# EAGLE schematic serra1 (EAGLE 7.5.0)
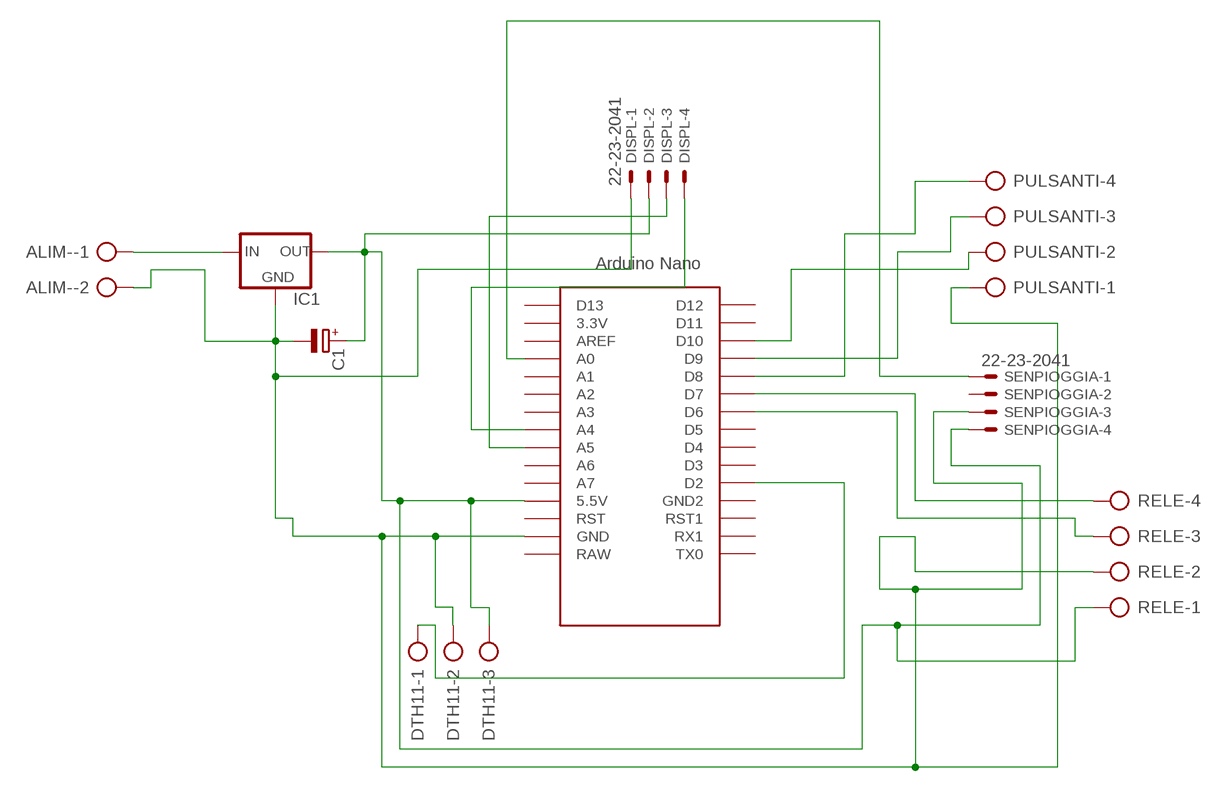
[diagram p0: schematic, sheet 1]

## Parts
ALIM-  AK500/2  [AK500/2]
C1  CPOL-EUE5-13  [E5-13]
DISPL  22-23-2041  [22-23-2041]
DTH11  AK500/3  [AK500/3]
IC1  78XXS  [78XXS]
PULSANTI  AK500/4  [AK500/4]
RELE  AK500/4  [AK500/4]
SENPIOGGIA  22-23-2041  [22-23-2041]
U$1  NANO  [NANO]

## Nets
DTH11: C1.+ DISPL.2 DTH11.3 IC1.OUT RELE.1 SENPIOGGIA.4 U$1.5V(5.5V)
N$1: ALIM-.1 IC1.IN
N$2: SENPIOGGIA.1 U$1.A0
N$3: RELE.4 U$1.D7
N$4: DISPL.3 U$1.A5
N$5: PULSANTI.2 U$1.D10
N$6: RELE.3 U$1.D6
N$7: DISPL.4 U$1.A4
N$8: DTH11.1 U$1.D2
N$9: ALIM-.2 C1.- DISPL.1 DTH11.2 IC1.GND PULSANTI.1 RELE.2 SENPIOGGIA.3 U$1.GND
N$10: PULSANTI.4 U$1.D8
N$12: PULSANTI.3 U$1.D9
Unconnected: SENPIOGGIA.2 U$1.3.3V U$1.A1 U$1.A2 U$1.A3 U$1.A6 U$1.A7 U$1.AREF U$1.D3 U$1.D4 U$1.D5 U$1.D11 U$1.D12 U$1.D13 U$1.GND1(GND2) U$1.ICSP1 U$1.ICSP2 U$1.ICSP3 U$1.ICSP4 U$1.ICSP5 U$1.ICSP6 U$1.RAW U$1.RST U$1.RST1 U$1.RX1 U$1.TX0

## Library data of the parts
ALIM- = con-pcb5mm:AK500/2: CONNECTOR; OC_FARNELL: unknown; OC_NEWARK: unknown
C1 = rcl:CPOL-EU: POLARIZED CAPACITOR, European symbol
DISPL SENPIOGGIA = con-molex:22-23-2041: .100" (2.54mm) Center Header - 4 Pin; MF: MOLEX; MPN: 22-23-2041; OC_FARNELL: 1462920; OC_NEWARK: 38C0355
DTH11 = con-pcb5mm:AK500/3: CONNECTOR; OC_FARNELL: unknown; OC_NEWARK: unknown
IC1 = v-reg:78XXS: VOLTAGE REGULATOR
PULSANTI = con-ptr500:AK500/4: CONNECTOR; OC_FARNELL: unknown; OC_NEWARK: unknown
RELE = con-pcb5mm:AK500/4: CONNECTOR; OC_FARNELL: unknown; OC_NEWARK: unknown
U$1 = Arduino-clone:NANO: Arduino Nano